# Altium project 555振荡器.PrjPCB
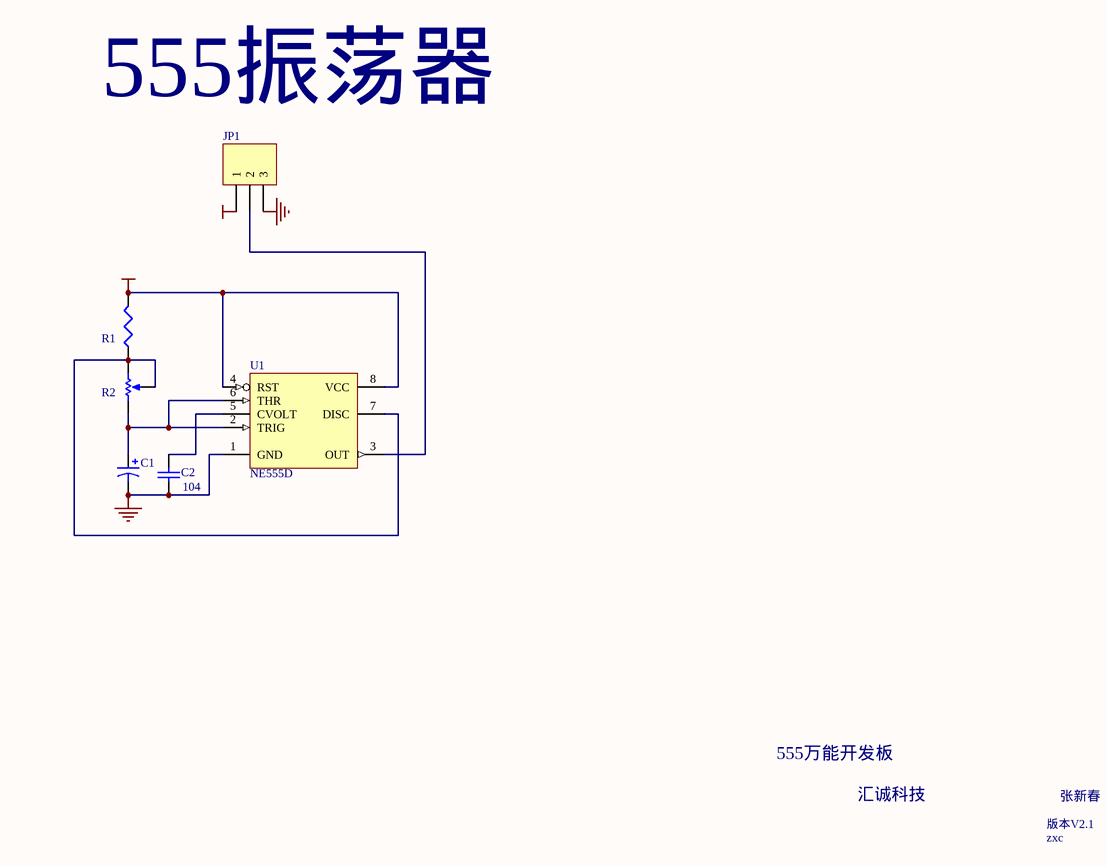
[diagram p0: 555振荡器.SchDoc]
1 sheet, 6 parts. Net scope: global (net labels, ports and power ports of the same name join across sheets).
Board file: 555振荡器_qft.PCBDOC

## Sheet 555振荡器.SchDoc
size A4

### Parts
C1  (no value)  [C-DJ-4]
C2  value 104  [C1608-0603]
JP1  (no value)  [HDR1X3]
R1  (no value)  [C1608-0603]
R2  (no value)  [SIP3-D]
U1  NE555D  [CDFP-8]

### Nets
GND: C1.2 C2.2 JP1.3 U1.1(GND)
VCC: JP1.1 R1.2 U1.4(RST) U1.8(VCC)
NetC1_1: C1.1 R2.1(TOP) U1.2(TRIG) U1.6(THR)
NetC2_1: C2.1 U1.5(CVOLT)
NetJP1_2: JP1.2 U1.3(OUT)
NetR1_1: R1.1 R2.2(BOT) R2.3(TAP) U1.7(DISC)

### Notes on the sheet
- 555振荡器
- 555万能开发板
- 汇诚科技
- 版本V2.1
- 张新春
- zxc

### Library data of the parts
C1 = Cap Pol1: Polarized Capacitor (Radial); Published: 8-Jun-2000; LatestRevisionDate: 17-Jul-2002; LatestRevisionNote: Re-released for DXP Platform.; Publisher: Altium Limited
C2 = Cap Semi: Capacitor (Semiconductor SIM Model); Published: 8-Jun-2000; LatestRevisionDate: 17-Jul-2002; LatestRevisionNote: Re-released for DXP Platform.; PackageReference: C1206; Publisher: Altium Limited
JP1 = Header 3: Header, 3-Pin; LatestRevisionDate: 17-Jul-2002; LatestRevisionNote: Re-released for DXP Platform.; Publisher: Altium Limited
R1 = Res3: Resistor; Published: 8-Jun-2000; LatestRevisionDate: 17-Jul-2002; LatestRevisionNote: Re-released for DXP Platform.; Publisher: Altium Limited
R2 = RPot: Potentiometer; Sim Note: Enter the Resistance value and the set point into parameter fields.; Set Position: 0.5; Published: 8-Jun-2000; LatestRevisionDate: 17-Jul-2002; LatestRevisionNote: Re-released for DXP Platform.; Publisher: Altium Limited
U1 = NE555D: Precision Timer; Manufacturer: Texas Instruments; Package Information: Latest Revision: Jan-1998; Class I: Analog; Class II: Timer Circuit; Published: 16-Jan-2001; Revision: July-2002: Re-released for DXP Platform.; Datasheet: Latest Revision: Feb-1992; Package Reference: D008; Publisher: Altium Limited